# Altium schematic sheet СОЕД.SchDoc
size A2; Organization: Altium Limited; Address1: L3, 12a Rodborough Rd; Address2: Frenchs Forest; Address3: NSW; Address4: Australia 2086
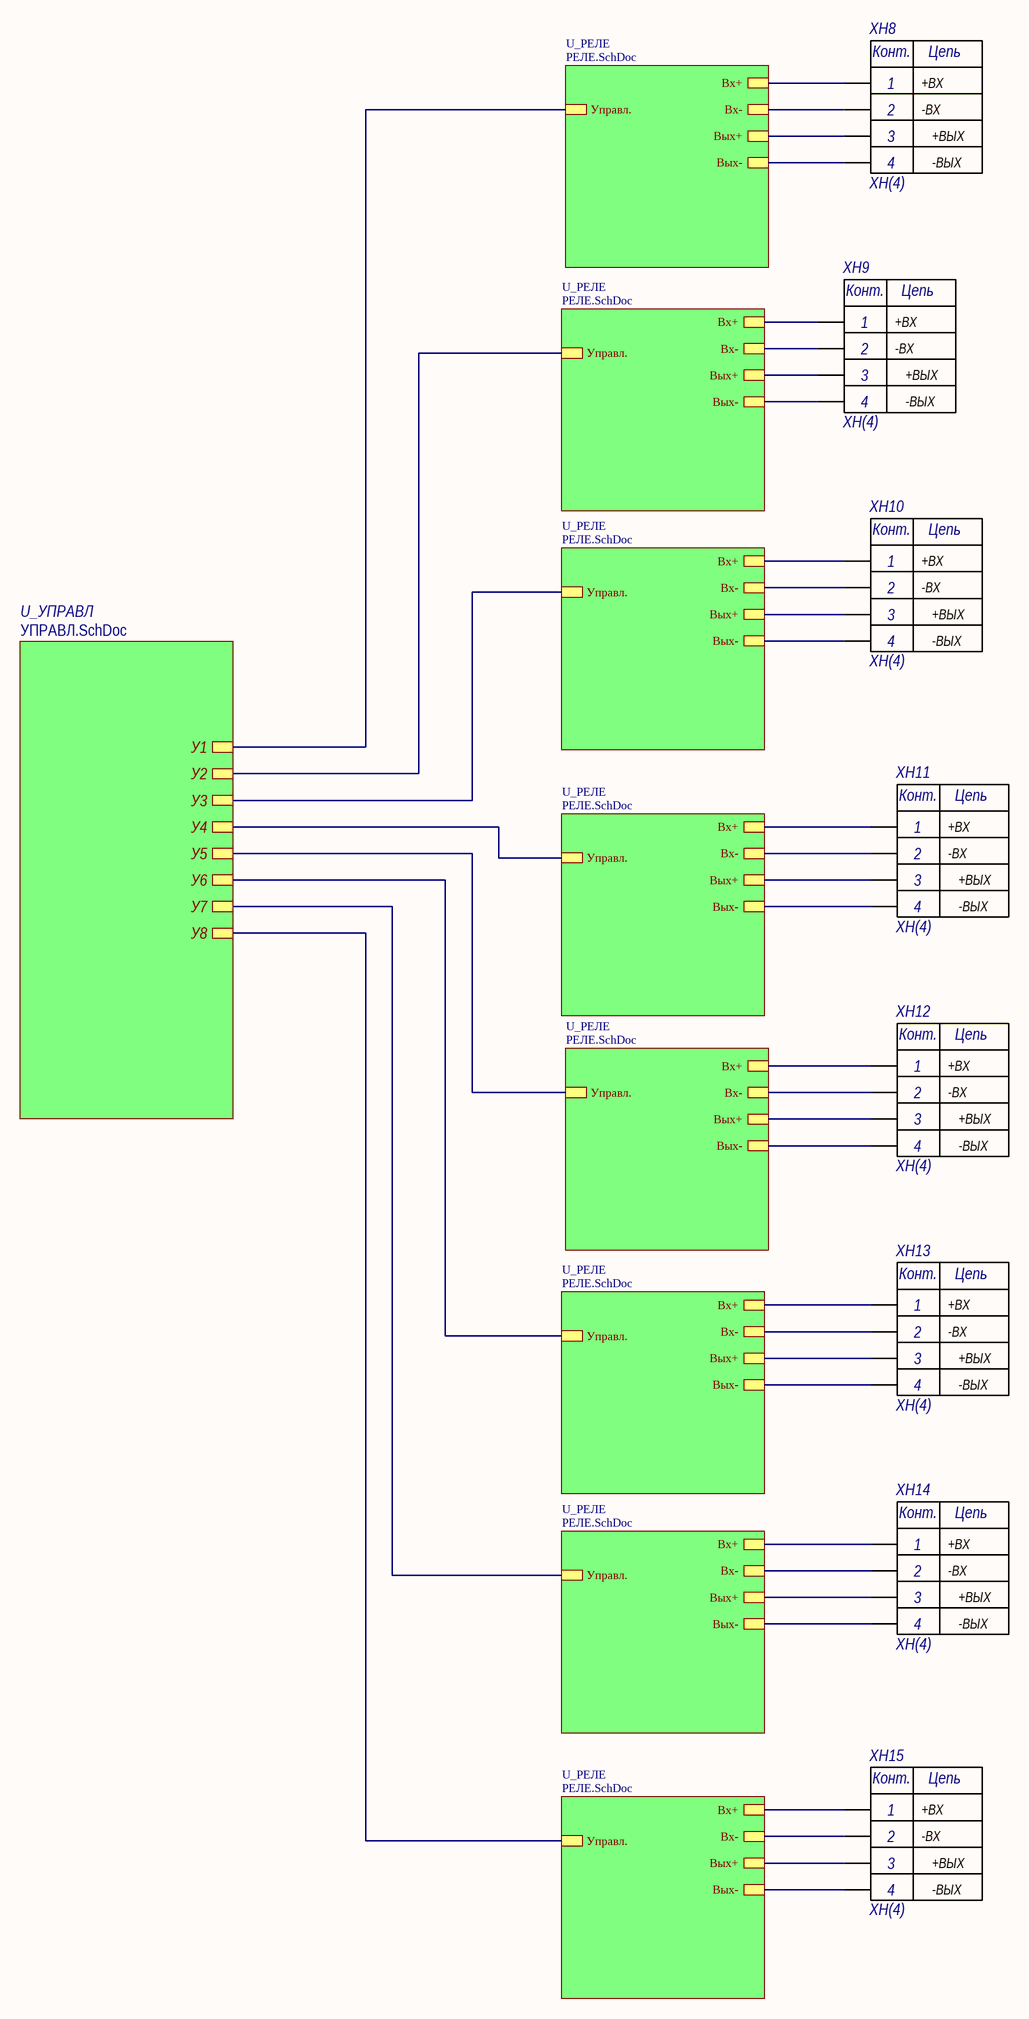
[diagram p0: СОЕД.SchDoc]

## Parts
XH8  ХН(4)  [ХН(4)]
XH9  ХН(4)  [ХН(4)]
XH10  ХН(4)  [ХН(4)]
XH11  ХН(4)  [ХН(4)]
XH12  ХН(4)  [ХН(4)]
XH13  ХН(4)  [ХН(4)]
XH14  ХН(4)  [ХН(4)]
XH15  ХН(4)  [ХН(4)]

## Sub-sheets
U_РЕЛЕ = РЕЛЕ.SchDoc: Управл., Вх+, Вх-, Вых-, Вых+
U_РЕЛЕ = РЕЛЕ.SchDoc: Управл., Вх+, Вх-, Вых-, Вых+
U_РЕЛЕ = РЕЛЕ.SchDoc: Управл., Вх+, Вх-, Вых-, Вых+
U_РЕЛЕ = РЕЛЕ.SchDoc: Управл., Вх+, Вх-, Вых-, Вых+
U_РЕЛЕ = РЕЛЕ.SchDoc: Управл., Вх+, Вх-, Вых-, Вых+
U_РЕЛЕ = РЕЛЕ.SchDoc: Управл., Вх+, Вх-, Вых-, Вых+
U_РЕЛЕ = РЕЛЕ.SchDoc: Управл., Вх+, Вх-, Вых-, Вых+
U_РЕЛЕ = РЕЛЕ.SchDoc: Управл., Вх+, Вх-, Вых-, Вых+
U_УПРАВЛ = УПРАВЛ.SchDoc: У1, У2, У3, У4, У5, У6, У7, У8

## Nets
NetXH8_1: XH8.1(+ВХ) ; sheet U_РЕЛЕ/Вх+
NetXH8_2: XH8.2(-ВХ) ; sheet U_РЕЛЕ/Вх-
NetXH8_3: XH8.3(+ВЫХ) ; sheet U_РЕЛЕ/Вых+
NetXH8_4: XH8.4(-ВЫХ) ; sheet U_РЕЛЕ/Вых-
NetXH9_1: XH9.1(+ВХ) ; sheet U_РЕЛЕ/Вх+
NetXH9_2: XH9.2(-ВХ) ; sheet U_РЕЛЕ/Вх-
NetXH9_3: XH9.3(+ВЫХ) ; sheet U_РЕЛЕ/Вых+
NetXH9_4: XH9.4(-ВЫХ) ; sheet U_РЕЛЕ/Вых-
NetXH10_1: XH10.1(+ВХ) ; sheet U_РЕЛЕ/Вх+
NetXH10_2: XH10.2(-ВХ) ; sheet U_РЕЛЕ/Вх-
NetXH10_3: XH10.3(+ВЫХ) ; sheet U_РЕЛЕ/Вых+
NetXH10_4: XH10.4(-ВЫХ) ; sheet U_РЕЛЕ/Вых-
NetXH11_1: XH11.1(+ВХ) ; sheet U_РЕЛЕ/Вх+
NetXH11_2: XH11.2(-ВХ) ; sheet U_РЕЛЕ/Вх-
NetXH11_3: XH11.3(+ВЫХ) ; sheet U_РЕЛЕ/Вых+
NetXH11_4: XH11.4(-ВЫХ) ; sheet U_РЕЛЕ/Вых-
NetXH12_1: XH12.1(+ВХ) ; sheet U_РЕЛЕ/Вх+
NetXH12_2: XH12.2(-ВХ) ; sheet U_РЕЛЕ/Вх-
NetXH12_3: XH12.3(+ВЫХ) ; sheet U_РЕЛЕ/Вых+
NetXH12_4: XH12.4(-ВЫХ) ; sheet U_РЕЛЕ/Вых-
NetXH13_1: XH13.1(+ВХ) ; sheet U_РЕЛЕ/Вх+
NetXH13_2: XH13.2(-ВХ) ; sheet U_РЕЛЕ/Вх-
NetXH13_3: XH13.3(+ВЫХ) ; sheet U_РЕЛЕ/Вых+
NetXH13_4: XH13.4(-ВЫХ) ; sheet U_РЕЛЕ/Вых-
NetXH14_1: XH14.1(+ВХ) ; sheet U_РЕЛЕ/Вх+
NetXH14_2: XH14.2(-ВХ) ; sheet U_РЕЛЕ/Вх-
NetXH14_3: XH14.3(+ВЫХ) ; sheet U_РЕЛЕ/Вых+
NetXH14_4: XH14.4(-ВЫХ) ; sheet U_РЕЛЕ/Вых-
NetXH15_1: XH15.1(+ВХ) ; sheet U_РЕЛЕ/Вх+
NetXH15_2: XH15.2(-ВХ) ; sheet U_РЕЛЕ/Вх-
NetXH15_3: XH15.3(+ВЫХ) ; sheet U_РЕЛЕ/Вых+
NetXH15_4: XH15.4(-ВЫХ) ; sheet U_РЕЛЕ/Вых-
(unnamed): sheet U_РЕЛЕ/Управл., sheet U_УПРАВЛ/У1
(unnamed): sheet U_УПРАВЛ/У2, sheet U_РЕЛЕ/Управл.
(unnamed): sheet U_УПРАВЛ/У3, sheet U_РЕЛЕ/Управл.
(unnamed): sheet U_УПРАВЛ/У4, sheet U_РЕЛЕ/Управл.
(unnamed): sheet U_УПРАВЛ/У5, sheet U_РЕЛЕ/Управл.
(unnamed): sheet U_УПРАВЛ/У6, sheet U_РЕЛЕ/Управл.
(unnamed): sheet U_УПРАВЛ/У7, sheet U_РЕЛЕ/Управл.
(unnamed): sheet U_УПРАВЛ/У8, sheet U_РЕЛЕ/Управл.

## Notes on the sheet
- Title
- Size:
- Date:
- File:
- A2
- Number:
- Time:
- Revision:
- Sheet
- of
- (in symbol ХН(4)) Конт.; Цепь